# Altium schematic sheet ADC_Interface_Opamp_NegRail_bu.SchDoc
size A4
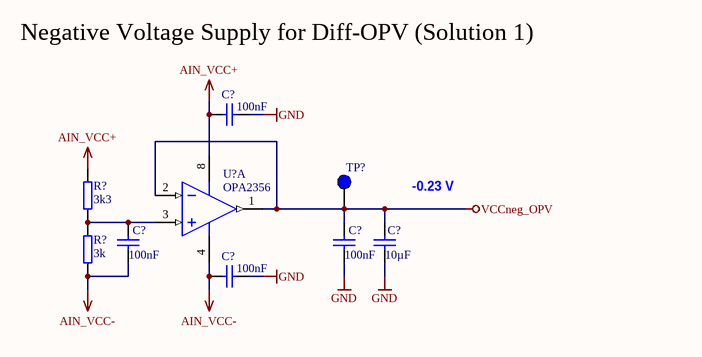
[diagram p0: ADC_Interface_Opamp_NegRail_bu.SchDoc]

## Parts
(Parts that share a designator on the sheet are numbered #1, #2 ... from top to bottom, then left to right.)
C?#1  100nF  [CAPC1608X07N]
C?#2  100nF  [CAPC1608X07N]
C?#3  100nF  [CAPC1608X07N]
C?#4  10µF  [C_0805_L]
C?#5  100nF  [CAPC1608X07N]
R?#1  3k3  [RESC1608X06N]
R?#2  3k  [RESC1608X06N]
TP?  5011  [Keystone 5011]  (value not drawn)
U?  OPA2356  [VSSOP-8_N]  (part A of 2)

## Nets
AIN_VCC+: C?#1.1 R?#1.2 U?.8(V+)
AIN_VCC-: C?#2.2 C?#5.1 R?#2.1 U?.4(V-)
GND: C?#1.2 C?#3.2 C?#4.1 C?#5.2
VCCneg_OPV: C?#3.1 C?#4.2 TP?.1 U?.1(OUT_A) U?.2(IN_A-)
NetC?#2_1: C?#2.1 R?#1.1 R?#2.2 U?.3(IN_A+)

## Notes on the sheet
- Negative Voltage Supply for Diff-OPV (Solution 1)
- -0.23 V
- Title:
- Project:
- Date:
- Revision:
- Design Engineer:
- Sheet
- of

## Library data of the parts
C?#1-C?#3 C?#5 = Cap_0603: MPN: CL10B104KB8WPNC; MF: Samsung Electro-Mechanics; Voltage: 50V; Dielectric: X7R; Value: 100nF; Supplier 1: Mouser; Supplier Part Number 1: 187-CL10B104KB8WPNC; Package: 0603
C?#4 = C_0805: Capacitor 0805 (2012 Metric); MPN: GCM21BR71A106KE22L; MF: Murata; Dielectric: X7R; Voltage: 10V; Automotive Qualification: AEC-Q200; Value: 10µF; Created: 2021_03_10_AGeiger; Supplier 1: Mouser; Supplier Part Number 1: 81-GCM21BR71A106KE2L; Package: 0805
R?#1 R?#2 = R_0603: Supplier 1: Mouser; Package: 0603
  R?#1: Value: 3k3
  R?#2: Value: 3k
TP? = Testpoint Keystone 5011: Testpoint for measurement probe; Hole Diameter: 1.6mm; MF: Keystone; MPN: 5011; Value: 5011
U? = OPA2356: 200 MHz GBW, CMOS Dual Operational Amplifier, 2.5 to 5.5 V, -40 to 125 degC, 8-pin SOP (DGK8), Green (RoHS & no Sb/Br); MPN: OPA2356AIDGKR; MF: Texas Instruments; OperationTempMin: -40°C; OperationTempMax: +125°C; ComponentLink3Description: Package Specification; ComponentLink1URL: http://www.ti.com/; ComponentLink2Description: Datasheet; ComponentLink2URL: http://www.ti.com/general/docs/lit/getliterature.tsp?genericPartNumber=OPA2356&fileType=pdf; ComponentLink1Description: Manufacturer URL; ComponentLink3URL: http://www.ti.com/litv/pdf/mpds028d; Value: OPA2356; Created: 2020_11_27_AGeiger